# Altium project 555_organator.PrjPcb
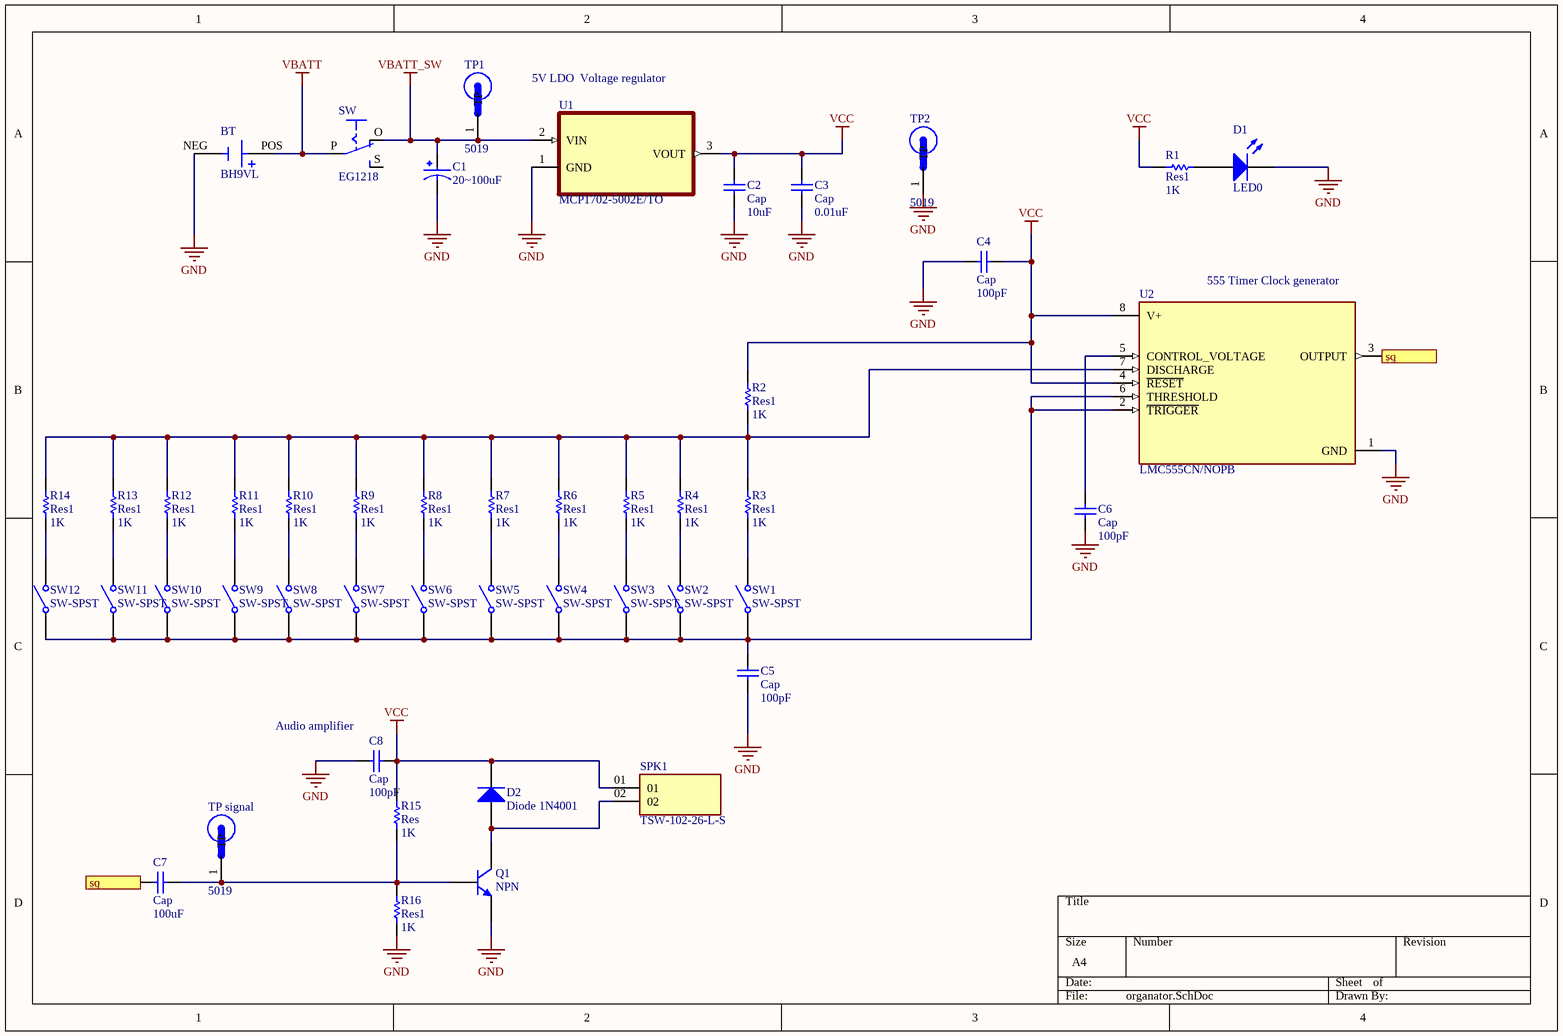
[diagram p0: organator.SchDoc]
1 sheet, 47 parts. Net scope: flat (ports and power ports of the same name join across sheets).
Board file: oraganator.PcbDoc

## Sheet organator.SchDoc
size A4

### Parts
BT  BH9VL  [BAT_BH9VL]
C1  20~100uF  [CAPPRD500W60D1000H2000]
C2  Cap  value 10uF  [RAD-0.3]
C3  Cap  value 0.01uF  [RAD-0.3]
C4  Cap  value 100pF  [RAD-0.3]
C5  Cap  value 100pF  [RAD-0.3]
C6  Cap  value 100pF  [RAD-0.3]
C7  Cap  value 100uF  [RAD-0.3]
C8  Cap  value 100pF  [RAD-0.3]
D1  LED0  [LED-0]
D2  Diode 1N4001  [DO-41]
Q1  NPN  [TO-226-AA]
R1  Res1  value 1K  [AXIAL-0.3]
R2  Res1  value 1K  [AXIAL-0.3]
R3  Res1  value 1K  [AXIAL-0.3]
R4  Res1  value 1K  [AXIAL-0.3]
R5  Res1  value 1K  [AXIAL-0.3]
R6  Res1  value 1K  [AXIAL-0.3]
R7  Res1  value 1K  [AXIAL-0.3]
R8  Res1  value 1K  [AXIAL-0.3]
R9  Res1  value 1K  [AXIAL-0.3]
R10  Res1  value 1K  [AXIAL-0.3]
R11  Res1  value 1K  [AXIAL-0.3]
R12  Res1  value 1K  [AXIAL-0.3]
R13  Res1  value 1K  [AXIAL-0.3]
R14  Res1  value 1K  [AXIAL-0.3]
R15  Res  value 1K  [AXIAL-0.3]
R16  Res1  value 1K  [AXIAL-0.3]
SPK1  TSW-102-26-L-S  [SAMTEC_TSW-102-26-L-S]
SW  EG1218  [EG1218]
SW1  SW-SPST  [SPST-2]
SW2  SW-SPST  [SPST-2]
SW3  SW-SPST  [SPST-2]
SW4  SW-SPST  [SPST-2]
SW5  SW-SPST  [SPST-2]
SW6  SW-SPST  [SPST-2]
SW7  SW-SPST  [SPST-2]
SW8  SW-SPST  [SPST-2]
SW9  SW-SPST  [SPST-2]
SW10  SW-SPST  [SPST-2]
SW11  SW-SPST  [SPST-2]
SW12  SW-SPST  [SPST-2]
TP1  5019  [TP380X203]
TP2  5019  [TP380X203]
TP_signal  5019  [TP380X203]
U1  MCP1702-5002E/TO  [TO127P254X533-3]
U2  LMC555CN/NOPB  [DIP794W45P254L959H508Q8]

### Ports
sq (in), sq (out)

### Nets
GND: BT.NEG C1.N C2.1 C3.1 C4.1 C5.1 C6.1 C8.2 D1.2(K) Q1.3(E) R16.1 TP2.1(TP) U1.1(GND) U2.1(GND)
VBATT: BT.POS SW.P
VBATT_SW: C1.P SW.O TP1.1(TP) U1.2(VIN)
VCC: C2.2 C3.2 C4.2 C8.1 D2.2(K) R1.1 R2.2 R15.2 SPK1.01 U1.3(VOUT) U2.4(~{RESET}) U2.8(V+)
NetC5_2: C5.2 SW1.1(COMMON) SW2.1(COMMON) SW3.1(COMMON) SW4.1(COMMON) SW5.1(COMMON) SW6.1(COMMON) SW7.1(COMMON) SW8.1(COMMON) SW9.1(COMMON) SW10.1(COMMON) SW11.1(COMMON) SW12.1(COMMON) U2.2(~{TRIGGER}) U2.6(THRESHOLD)
NetC6_2: C6.2 U2.5(CONTROL_VOLTAGE)
NetC7_1: C7.1 Q1.2(B) R15.1 R16.2 TP_signal.1(TP)
NetC7_2: C7.2 U2.3(OUTPUT) ; port sq
NetD1_1: D1.1(A) R1.2
NetD2_1: D2.1(A) Q1.1(C) SPK1.02
NetR2_1: R2.1 R3.2 R4.2 R5.2 R6.2 R7.2 R8.2 R9.2 R10.2 R11.2 R12.2 R13.2 R14.2 U2.7(DISCHARGE)
NetR3_1: R3.1 SW1.2(NO)
NetR4_1: R4.1 SW2.2(NO)
NetR5_1: R5.1 SW3.2(NO)
NetR6_1: R6.1 SW4.2(NO)
NetR7_1: R7.1 SW5.2(NO)
NetR8_1: R8.1 SW6.2(NO)
NetR9_1: R9.1 SW7.2(NO)
NetR10_1: R10.1 SW8.2(NO)
NetR11_1: R11.1 SW9.2(NO)
NetR12_1: R12.1 SW10.2(NO)
NetR13_1: R13.1 SW11.2(NO)
NetR14_1: R14.1 SW12.2(NO)

Not connected (* = marked no-connect by the designer): SW S

### Notes on the sheet
- 5V LDO  Voltage regulator
- (near U2) 555 Timer Clock generator
- (near C8) Audio amplifier

### Library data of the parts
BT = BH9VL: Battery Holder _Open_ 9V 1 Cell Solder Lug; MF: MPD; Availability: Unavailable; MP: BH9VL; Price: None; Value: *; SnapEDA_Link: https://www.snapeda.com/parts/BH9VL/MPD/view-part/4480504/?ref=snap; Package: None
C1 = EEUFC1C821B: 820F 16V Aluminum Electrolytic Capacitors Radial, Can 3000 Hrs @ 105C; MF: Panasonic; MP: EEU-FC1C821B; Price: None; Check_prices: https://www.snapeda.com/parts/EEU-FC1C821B/Panasonic/view-part/?ref=eda; SnapEDA_Link: https://www.snapeda.com/parts/EEU-FC1C821B/Panasonic/view-part/?ref=snap; Availability: In Stock; Value: *; Package: RADIAL-2 Panasonic; Purchase-URL: https://pricing.snapeda.com/search/part/EEU-FC1C821B/?ref=eda
C2-C8 = Cap: Capacitor; Published: 8-Jun-2000; LatestRevisionDate: 17-Jul-2002; LatestRevisionNote: Re-released for DXP Platform.; PackageReference: RAD-0.3; Publisher: Altium Limited; PackageDescription: Radial Cap, Thru-Hole; 2 Leads; 0.3 in Pin Spacing
D1 = LED0: Typical INFRARED GaAs LED; Published: 8-Jun-2000; LatestRevisionDate: 08-Jul-2005; LatestRevisionNote: Mech Layer 1 removed.; PackageReference: LED-0; Publisher: Altium Limited; PackageDescription: LED; 2 Leads
D2 = Diode 1N4001: 1 Amp General Purpose Rectifier; Published: 8-Jun-2000; LatestRevisionDate: 17-Jul-2002; LatestRevisionNote: Re-released for DXP Platform.; DatasheetVersion: 1998; PackageVersion: Aug-1999; PackageReference: DO-41; Publisher: Altium Limited; PackageDescription: Diode, Axial; Body 5.2 x 2.7 mm (LxDia. max), Lead Dia. 0.86 mm (max); Code_JEDEC: DO-204-AL; ComponentLink1Description: Manufacturer Link; ComponentLink1URL: http://www.fairchildsemi.com/; ComponentLink2Description: Datasheet; ComponentLink2URL: http://www.fairchildsemi.com/ds/1N%2F1N4001.pdf
Q1 = NPN: NPN Bipolar Transistor; Published: 8-Jun-2000; LatestRevisionDate: 17-Jul-2002; LatestRevisionNote: Re-released for DXP Platform.; PackageReference: TO-226-AA; Publisher: Altium Limited; PackageDescription: TO, Flat Index; 3 In-Line, Axial Leads; Body Dia. 4.8mm; Leads 0.55 x 0.51 mm (max); Code_JEDEC: TO-226-AA
R1-R16 = Res1: Resistor; Published: 8-Jun-2000; LatestRevisionDate: 17-Jul-2002; LatestRevisionNote: Re-released for DXP Platform.; PackageReference: AXIAL-0.3; Publisher: Altium Limited; PackageDescription: Axial Device, Thru-Hole; 2 Leads; 0.3 in Pin Spacing
SW = EG1218: æ»‘å‹•é–‹é—œSPDTé€šå­”; MF: E-Switch; Package: Custom package E-Switch; Price: None; MP: EG1218; Availability: Unavailable; Value: *; SnapEDA_Link: https://www.snapeda.com/parts/EG1218/E-Switch/view-part/13895/?ref=snap
SW1-SW12 = SW-SPST: Single-Pole, Single-Throw Switch; Published: 24-Mar-1999; LatestRevisionDate: 17-Jul-2002; LatestRevisionNote: Re-released for DXP Platform.; PackageReference: SPST-2; Publisher: Altium Limited; PackageDescription: Switch; 2 Leads
TP1 TP2 TP_signal = 5019: PC Test Point, Miniature Phosphor Bronze, Silver Plating Surface Mount Mounting Type; MF: Keystone Electronics; Value: *; MP: 5019; Package: 2010 Keystone; SnapEDA_Link: https://www.snapeda.com/parts/5019/Keystone%20Electronics/view-part/449144/?ref=snap; Digi-Key_Part_Number: 36-5019CT-ND; Digi-Key_Purchase_URL: https://www.digikey.com/product-detail/en/keystone-electronics/5019/36-5019CT-ND/3907344?utm_source=snapeda&utm_medium=aggregator&utm_campaign=symbol
U1 = MCP1702-5002E/TO: Linear Voltage Regulator IC 1 Output 250mA TO-92-3; MF: Microchip; SnapEDA_Link: https://www.snapeda.com/parts/MCP1702-5002E/TO/Microchip/view-part/263943/?ref=snap; Availability: Unavailable; MP: MCP1702-5002E/TO; Package: TO-92 Microchip; Price: None; Value: *
SPK1 = TSW-102-26-L-S: Package: None; Price: None; Value: *; MP: TSW-102-26-L-S; Availability: Unavailable
U2 = LMC555CN/NOPB: Price: None; Package: None; Availability: Unavailable; MP: LMC555CN/NOPB; Value: *